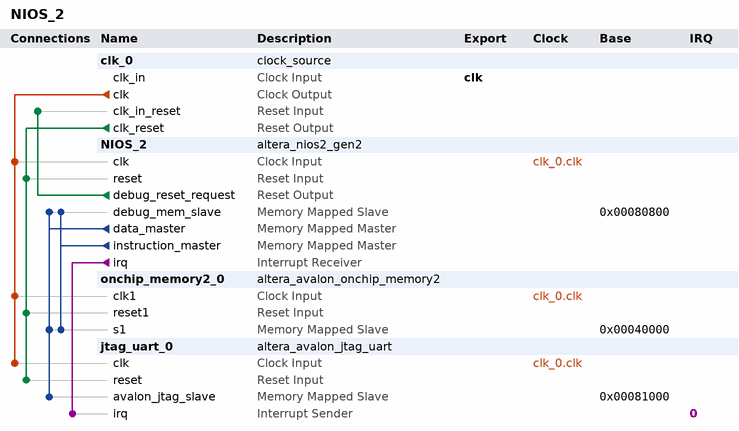
[diagram p0: system contents]
# Platform Designer (Qsys) system NIOS_2, MAX 10 10M50DAF484C6GES
# Parameters at their usual value, and those the tool derives, are not listed.
package require -exact qsys 16.1
create_system NIOS_2
set_project_property DEVICE_FAMILY {MAX 10}
set_project_property DEVICE 10M50DAF484C6GES

add_instance clk_0 clock_source 16.1
set_instance_parameter_value clk_0 clockFrequency 50000000

add_instance NIOS_2 altera_nios2_gen2 16.1
set_instance_parameter_value NIOS_2 dcache_size 2048
set_instance_parameter_value NIOS_2 exceptionSlave onchip_memory2_0.s1
set_instance_parameter_value NIOS_2 icache_size 4096
set_instance_parameter_value NIOS_2 impl Tiny
set_instance_parameter_value NIOS_2 resetSlave onchip_memory2_0.s1

add_instance onchip_memory2_0 altera_avalon_onchip_memory2 16.1
set_instance_parameter_value onchip_memory2_0 dataWidth 32
set_instance_parameter_value onchip_memory2_0 dualPort false
set_instance_parameter_value onchip_memory2_0 initMemContent true
set_instance_parameter_value onchip_memory2_0 initializationFileName onchip_mem.hex
set_instance_parameter_value onchip_memory2_0 memorySize 179200

add_instance jtag_uart_0 altera_avalon_jtag_uart 16.1
set_instance_parameter_value jtag_uart_0 simInteractiveOptions NO_INTERACTIVE_WINDOWS

# connections
add_connection clk_0.clk jtag_uart_0.clk clock
add_connection clk_0.clk NIOS_2.clk clock
add_connection clk_0.clk onchip_memory2_0.clk1 clock
add_connection clk_0.clk_reset jtag_uart_0.reset reset
add_connection clk_0.clk_reset NIOS_2.reset reset
add_connection clk_0.clk_reset onchip_memory2_0.reset1 reset
add_connection NIOS_2.debug_reset_request clk_0.clk_in_reset reset
add_connection NIOS_2.data_master jtag_uart_0.avalon_jtag_slave avalon
set_connection_parameter_value NIOS_2.data_master/jtag_uart_0.avalon_jtag_slave baseAddress 0x00081000
add_connection NIOS_2.data_master NIOS_2.debug_mem_slave avalon
set_connection_parameter_value NIOS_2.data_master/NIOS_2.debug_mem_slave baseAddress 0x00080800
add_connection NIOS_2.data_master onchip_memory2_0.s1 avalon
set_connection_parameter_value NIOS_2.data_master/onchip_memory2_0.s1 baseAddress 0x00040000
add_connection NIOS_2.instruction_master NIOS_2.debug_mem_slave avalon
set_connection_parameter_value NIOS_2.instruction_master/NIOS_2.debug_mem_slave baseAddress 0x00080800
add_connection NIOS_2.instruction_master onchip_memory2_0.s1 avalon
set_connection_parameter_value NIOS_2.instruction_master/onchip_memory2_0.s1 baseAddress 0x00040000
add_connection NIOS_2.irq jtag_uart_0.irq interrupt
set_connection_parameter_value NIOS_2.irq/jtag_uart_0.irq irqNumber 0

# exported interfaces
add_interface clk clock sink
set_interface_property clk EXPORT_OF clk_0.clk_in

set_interconnect_requirement {$system} qsys_mm.clockCrossingAdapter HANDSHAKE
set_interconnect_requirement {$system} qsys_mm.enableEccProtection FALSE
set_interconnect_requirement {$system} qsys_mm.insertDefaultSlave FALSE
set_interconnect_requirement {$system} qsys_mm.maxAdditionalLatency 1

save_system NIOS_2.qsys
